# EAGLE design tf520 (EAGLE 7.7.0)

## Sheet 1 of 2
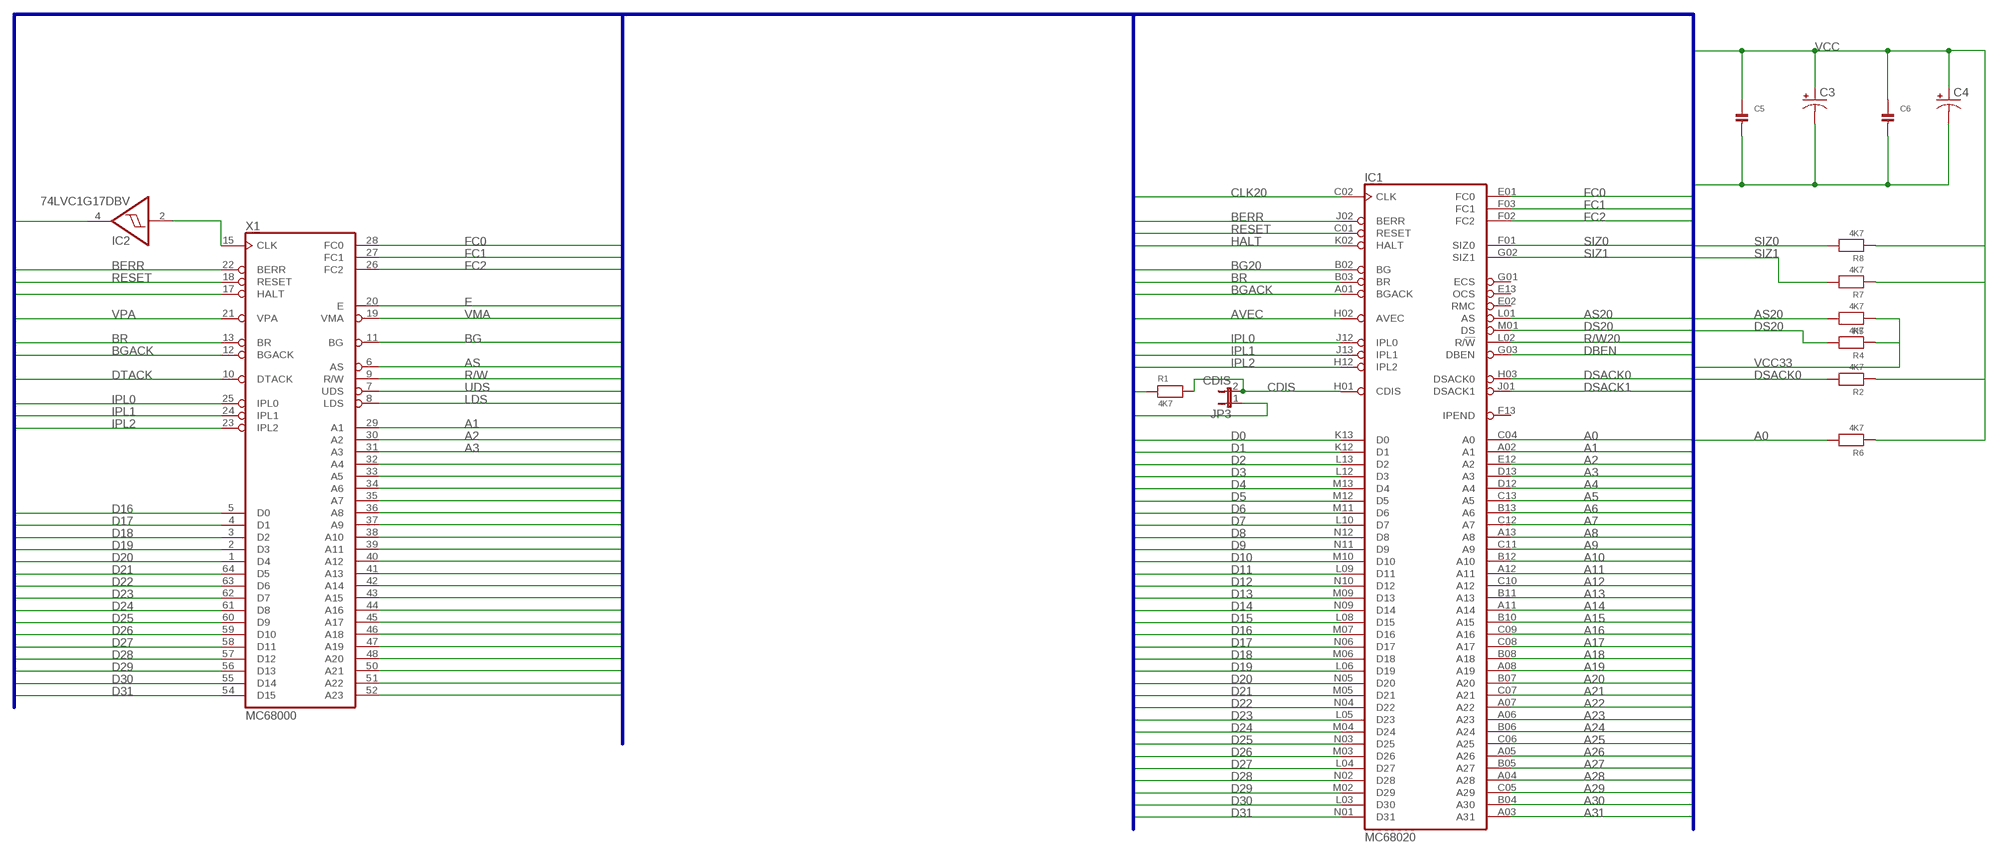
[diagram p0: schematic, sheet 1]

### Parts
C3  CAP_POLD  [PANASONIC_D]
C4  CAP_POLD  [PANASONIC_D]
C5  CAP_CERAMIC1206  [1206]
C6  CAP_CERAMIC1206  [1206]
IC1  MC68020  MC68020RC  [MPGA114]
IC2  74LVC1G17DBV  [SOT23-5]
JP3  CDIS  JUMPER-2PTH  [1X02]
R1  4K7  RESISTOR1206  [1206]
R2  4K7  RESISTOR1206  [1206]
R4  4K7  RESISTOR1206  [1206]
R5  4K7  RESISTOR1206  [1206]
R6  4K7  RESISTOR1206  [1206]
R7  4K7  RESISTOR1206  [1206]
R8  4K7  RESISTOR1206  [1206]
X1  MC68000  MC68000P  [DIL64]

### Nets
A0: IC1.C04(A0) R6.2 ; also sheet 2
A1: IC1.A02(A1) X1.29(A1)
A2: IC1.E12(A2) X1.30(A2)
A3: IC1.D13(A3) X1.31(A3)
A4: IC1.D12(A4) X1.32(A4)
A5: IC1.C13(A5) X1.33(A5)
A6: IC1.B13(A6) X1.34(A6)
A7: IC1.C12(A7) X1.35(A7)
A8: IC1.A13(A8) X1.36(A8)
A9: IC1.C11(A9) X1.37(A9)
A10: IC1.B12(A10) X1.38(A10)
A11: IC1.A12(A11) X1.39(A11)
A12: IC1.C10(A12) X1.40(A12)
A13: IC1.B11(A13) X1.41(A13)
A14: IC1.A11(A14) X1.42(A14)
A15: IC1.B10(A15) X1.43(A15)
A16: IC1.C09(A16) X1.44(A16) ; also sheet 2
A17: IC1.C08(A17) X1.45(A17) ; also sheet 2
A18: IC1.B08(A18) X1.46(A18) ; also sheet 2
A19: IC1.A08(A19) X1.47(A19) ; also sheet 2
A20: IC1.B07(A20) X1.48(A20)
A21: IC1.C07(A21) X1.50(A21)
A22: IC1.A07(A22) X1.51(A22)
A23: IC1.A06(A23) X1.52(A23)
A24: IC1.B06(A24)
A25: IC1.C06(A25)
A26: IC1.A05(A26)
A27: IC1.B05(A27)
A28: IC1.A04(A28)
A29: IC1.C05(A29)
A30: IC1.B04(A30)
A31: IC1.A03(A31)
AS: X1.6(AS) ; also sheet 2
AS20: IC1.L01(AS) R5.2 ; also sheet 2
AVEC: IC1.H02(AVEC) ; also sheet 2
BERR: IC1.J02(BERR) X1.22(BERR) ; also sheet 2
BG: X1.11(BG) ; also sheet 2
BG20: IC1.B02(BG) ; also sheet 2
BGACK: IC1.A01(BGACK) X1.12(BGACK) ; also sheet 2
BR: IC1.B03(BR) X1.13(BR)
CDIS: IC1.H01(CDIS) JP3.2 R1.2
CLK7M: IC2.4(O) ; also sheet 2
CLK7M_RAW: IC2.2(I) X1.15(CLK)
CLK20: IC1.C02(CLK) ; also sheet 2
D0: IC1.K13(D0)
D1: IC1.K12(D1)
D2: IC1.L13(D2)
D3: IC1.L12(D3)
D4: IC1.M13(D4)
D5: IC1.M12(D5)
D6: IC1.M11(D6)
D7: IC1.L10(D7)
D8: IC1.N12(D8)
D9: IC1.N11(D9)
D10: IC1.M10(D10)
D11: IC1.L09(D11)
D12: IC1.N10(D12)
D13: IC1.M09(D13)
D14: IC1.N09(D14)
D15: IC1.L08(D15)
D16: IC1.M07(D16) X1.5(D0)
D17: IC1.N06(D17) X1.4(D1)
D18: IC1.M06(D18) X1.3(D2)
D19: IC1.L06(D19) X1.2(D3)
D20: IC1.N05(D20) X1.1(D4)
D21: IC1.M05(D21) X1.64(D5)
D22: IC1.N04(D22) X1.63(D6)
D23: IC1.L05(D23) X1.62(D7)
D24: IC1.M04(D24) X1.61(D8)
D25: IC1.N03(D25) X1.60(D9)
D26: IC1.M03(D26) X1.59(D10)
D27: IC1.L04(D27) X1.58(D11)
D28: IC1.N02(D28) X1.57(D12)
D29: IC1.M02(D29) X1.56(D13)
D30: IC1.L03(D30) X1.55(D14)
D31: IC1.N01(D31) X1.54(D15)
DBEN: IC1.G03(DBEN)
DS20: IC1.M01(DS) R4.2 ; also sheet 2
DSACK0: IC1.H03(DSACK0) R2.2
DSACK1: IC1.J01(DSACK1) ; also sheet 2
DTACK: X1.10(DTACK) ; also sheet 2
E: X1.20(E) ; also sheet 2
FC0: IC1.E01(FC0) X1.28(FC0) ; also sheet 2
FC1: IC1.F03(FC1) X1.27(FC1) ; also sheet 2
FC2: IC1.F02(FC2) X1.26(FC2) ; also sheet 2
GND: C3.- C4.- C5.2 C6.2 JP3.1 ; also sheet 2
HALT: IC1.K02(HALT) X1.17(HALT) ; also sheet 2
IPL0: IC1.J12(IPL0) X1.25(IPL0)
IPL1: IC1.J13(IPL1) X1.24(IPL1)
IPL2: IC1.H12(IPL2) X1.23(IPL2)
LDS: X1.8(LDS) ; also sheet 2
R/W: X1.9(R/W) ; also sheet 2
R/W20: IC1.L02(R/!W) ; also sheet 2
RESET: IC1.C01(RESET) X1.18(RESET) ; also sheet 2
SIZ0: IC1.F01(SIZ0) R8.2 ; also sheet 2
SIZ1: IC1.G02(SIZ1) R7.2 ; also sheet 2
UDS: X1.7(UDS) ; also sheet 2
VCC: C3.+ C4.+ C5.1 C6.1 R1.1 R2.1 R6.1 R7.1 R8.1 ; also sheet 2
VCC33: R4.1 R5.1 ; also sheet 2
VMA: X1.19(VMA) ; also sheet 2
VPA: X1.21(VPA) ; also sheet 2
Unconnected: IC1.E02(RMC) IC1.E13(OCS) IC1.F13(IPEND) IC1.G01(ECS)

### Buses
VCC33,VCC,GND,CLK7M,A[0..31],D[0..31],IPL[0..2],FC[0..2],DSACK[0..1],BR,BGACK,R/W20,R/W,CLK20,AS20,DS20,BG20,AVEC,SIZ[0..1],DBEN,BERR,RESET,HALT,BG,VPA,VMA,E,AS,UDS,LDS,DTACK

## Sheet 2 of 2
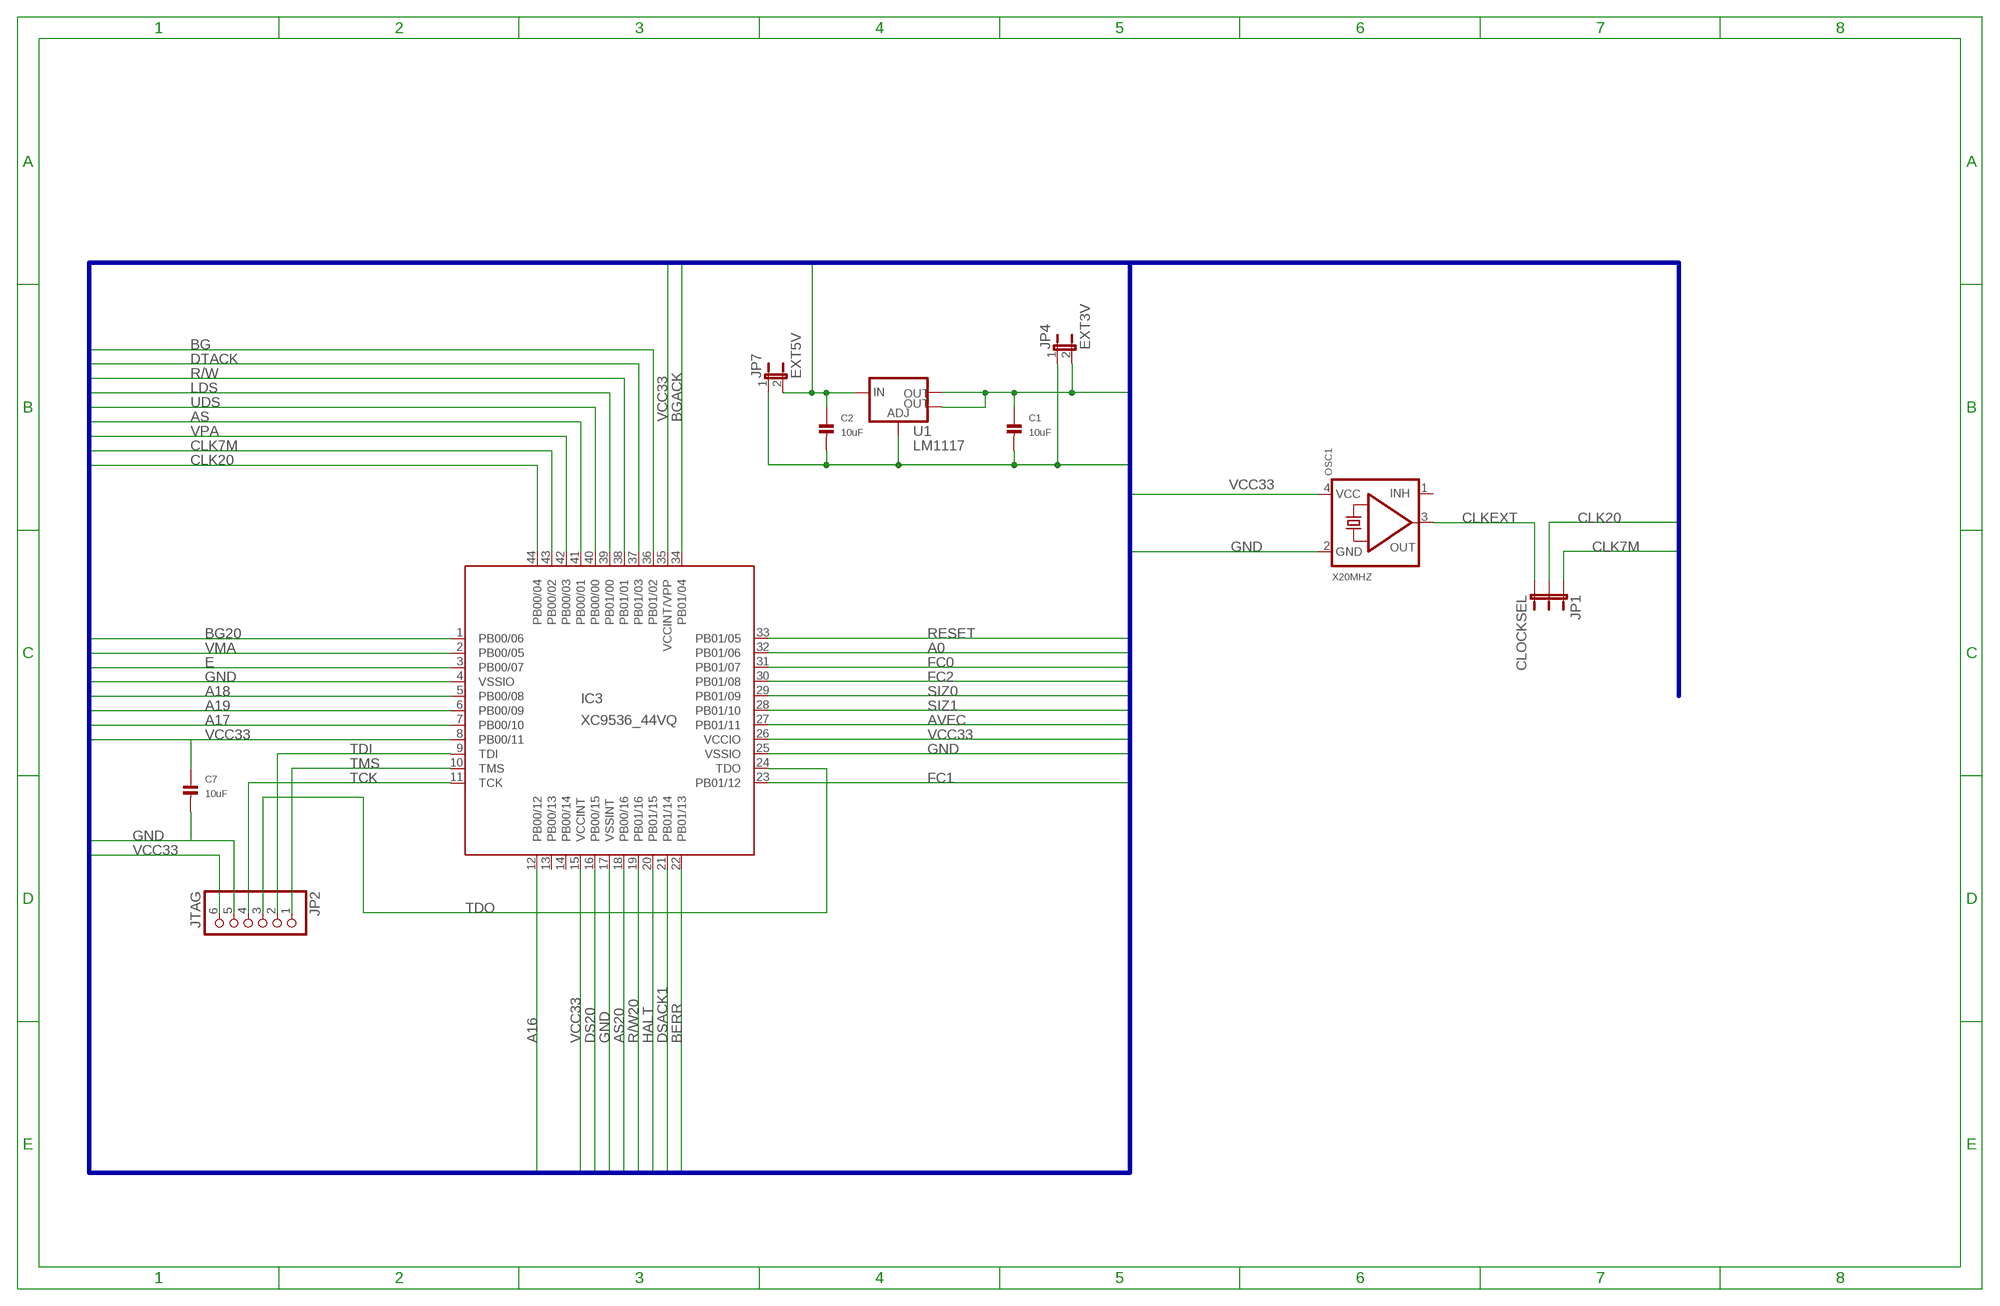
[diagram p1: schematic, sheet 2]

### Parts
C1  10uF  CAP_CERAMIC1206  [1206]
C2  10uF  CAP_CERAMIC1206  [1206]
C7  10uF  CAP_CERAMIC1206  [1206]
IC3  XC9536_44VQ  [SQFP-S-10X10-44]
JP1  CLOCKSEL  JUMPER-3PTH  [1X03]
JP2  JTAG  HEADER-1X6ROUND  [1X06_ROUND]
JP4  EXT3V  JUMPER-2PTH  [1X02]
JP7  EXT5V  JP1E  [JP1]
OSC1  X20MHZ  OSCILLATOR  [OSC_7X5MM]
U1  LM1117  V_REG_LM1117SOT223  [SOT223]

### Nets
A0: IC3.32(PB01/06) ; also sheet 1
A16: IC3.12(PB00/12) ; also sheet 1
A17: IC3.7(PB00/10) ; also sheet 1
A18: IC3.5(PB00/08) ; also sheet 1
A19: IC3.6(PB00/09) ; also sheet 1
AS: IC3.41(PB00/01) ; also sheet 1
AS20: IC3.18(PB00/16) ; also sheet 1
AVEC: IC3.27(PB01/11) ; also sheet 1
BERR: IC3.22(PB01/13) ; also sheet 1
BG: IC3.36(PB01/02) ; also sheet 1
BG20: IC3.1(PB00/06) ; also sheet 1
BGACK: IC3.34(PB01/04) ; also sheet 1
CLK7M: IC3.43(PB00/02) JP1.1 ; also sheet 1
CLK20: IC3.44(PB00/04) JP1.2 ; also sheet 1
CLKEXT: JP1.3 OSC1.3(OUT)
DS20: IC3.16(PB00/15) ; also sheet 1
DSACK1: IC3.21(PB01/14) ; also sheet 1
DTACK: IC3.37(PB01/03) ; also sheet 1
E: IC3.3(PB00/07) ; also sheet 1
FC0: IC3.31(PB01/07) ; also sheet 1
FC1: IC3.23(PB01/12) ; also sheet 1
FC2: IC3.30(PB01/08) ; also sheet 1
GND: C1.2 C2.2 C7.2 IC3.4(VSSIO) IC3.17(VSSINT) IC3.25(VSSIO) JP2.5 JP4.1 JP7.1 OSC1.2(GND) U1.1(ADJ) ; also sheet 1
HALT: IC3.20(PB01/15) ; also sheet 1
LDS: IC3.39(PB01/00) ; also sheet 1
R/W: IC3.38(PB01/01) ; also sheet 1
R/W20: IC3.19(PB01/16) ; also sheet 1
RESET: IC3.33(PB01/05) ; also sheet 1
SIZ0: IC3.29(PB01/09) ; also sheet 1
SIZ1: IC3.28(PB01/10) ; also sheet 1
TCK: IC3.11(TCK) JP2.4
TDI: IC3.9(TDI) JP2.2
TDO: IC3.24(TDO) JP2.3
TMS: IC3.10(TMS) JP2.1
UDS: IC3.40(PB00/00) ; also sheet 1
VCC: C2.1 JP7.2 U1.3(IN) ; also sheet 1
VCC33: C1.1 C7.1 IC3.8(PB00/11) IC3.15(VCCINT) IC3.26(VCCIO) IC3.35(VCCINT/VPP) JP2.6 JP4.2 OSC1.4(VCC) U1.2(OUT) U1.4(OUT) ; also sheet 1
VMA: IC3.2(PB00/05) ; also sheet 1
VPA: IC3.42(PB00/03) ; also sheet 1
Unconnected: IC3.13(PB00/13) IC3.14(PB00/14) OSC1.1(INH)

### Buses
VCC33,VCC,GND,CLK7M,A[0..31],D[0..31],IPL[0..2],FC[0..2],DSACK[0..1],BR,BGACK,R/W20,R/W,CLK20,AS20,DS20,BG20,AVEC,SIZ[0..1],DBEN,BERR,RESET,HALT,BG,VPA,VMA,E,AS,UDS,LDS,DTACK

## Power pins joined to a net without a drawn wire
GND: IC1.A10(GND) IC1.B01(GND) IC1.B09(GND) IC1.C03(GND) IC1.F12(GND) IC1.G12(GND) IC1.H13(GND) IC1.J03(GND) IC1.K01(GND) IC1.K03(GND) IC1.L07(GND) IC1.L11(GND) IC1.N07(GND) IC2.3(GND) X1.16(GND) X1.53(GND)
VCC: IC1.A09(VCC) IC1.D01(VCC) IC1.D02(VCC) IC1.D03(VCC) IC1.E03(VCC) IC1.G11(VCC) IC1.G13(VCC) IC1.M08(VCC) IC1.N08(VCC) IC1.N13(VCC) IC2.5(VCC) X1.14(VCC) X1.49(VCC)

## Library data of the parts
C1 C2 C5-C7 = microbuilder:CAP_CERAMIC: Ceramic Capacitors 0402 - 0402 Surface Mount Capacitors 16pF 50V 5% [Digikey: 445-4899-2-ND] 18pF 50V 5% [Digikey: 490-1281-2-ND] 22pF 50V 5% [Digikey: 490-1283-2-ND] 68pF 50V 5% [Digikey: 490-1289-2-ND] 0.1uF 10V 10% [Digikey: 490-1318-2-ND] 1.0uF 6.3V 10% [Digikey: 490-1320-2-ND] 0603 - 0603 Surface Mount Capacitors 16 pF 50V 5% [Digikey: 445-5051-2-ND] 22 pF 50V [Digikey: PCC220ACVTR-ND] 33 pF 50V 5% [Digikey: 490-1415-1-ND] 56pF 50V 5% [Digikey: 490-1421-1-ND] 220pF 50V 5% [Digikey: 445-1285-1-ND] 680 pF 50V 2200 pF 50V 5% C0G [Digikey: 445-1297-1-ND] 5600 pF 100V 5% X7R [Digikey: 478-3711-1-ND] 0.1 µF 25V 10% [Digikey: PCC2277TR-ND] 0.22 µF 16V 10% X7R [Digikey: 445-1318-1-ND] 1.0 µF 25V 10% [Digikey: 445-5146-2-ND] 0603 - RF Specific 3pF 250V +/-0.1pF RF [Digikey: 712-1347-1-ND] 18 pF 250V 5% [Digikey: 478-3505-1-ND or 712-1322-1-ND] 56 pF 250V 5% C0G RF [Digikey: 490-4867-1-ND] 68 pF 250V RF [Digikey: 490-4868-1-ND] 0805 - 0805 Surface Mount Capacitors 220 pF 250V 2% RF Ceramic Capacitor [Digikey: 712-1398-1-ND] 1000 pF 50V 2% NP0 Ceramic Capacitor [Digikey: 478-3760-1-ND] 0.1 µF 25V 10% Ceramic Capacitor [Digikey: PCC1828TR-ND] 1.0 µF 16V 10% Ceramic Capacitor[Digikey: 490-1691-2-ND] 10.0 µF 10V 10% Ceramic Capacitor[Digikey: 709-1228-1-ND] 10.0 uF 16V 10% Ceramic Capacitor [Digikey: 478-5165-2-ND] 47 uF 6.3V 20% Ceramic Capacitor [Digikey: 587-1779-1-ND or 399-5506-1-ND] 1206 - 1206 Surface Mount Capacitors 47uF 10V 20% Ceramic Capacitor [Digikey: 490-5528-1-ND or 399-5508-1-ND or 445-6010-1-ND] 100uF 6.3V -20%, +80% Y5V Ceramic Capacitor (Digikey: 490-4512-1-ND, Mouser: 81-GRM31CF50J107ZE1L)
C3 C4 = SparkFun-Capacitors:CAP_POL: Capacitor Polarized These are standard SMD and PTH capacitors. Normally 10uF, 47uF, and 100uF in electrolytic and tantalum varieties. Always verify the external diameter of the through hole cap, it varies with capacity, voltage, and manufacturer. The EIA devices should be standard.
IC1 = micro-mc68000:MC68020RC: 68xxx PROCESSOR; MF: MOTOROLA; MPN: MC68020RC33E; OC_FARNELL: 1579779; OC_NEWARK: 66F7091
IC2 = 74xx-little-de:74*1G17: Single Schmitt-Trigger Buffer
IC3 = xilinx-xc9:XC9536_44VQ: xc9536_pc44 XC9500 In-System Programmable CPLD Family Auto generated by make-symbol-device-package-bsdl.ulp Rev. 34 Source: xc9536_vq44.bsd; MPN: XC9536-15VQG44C; OC_FARNELL: 1193227; OC_NEWARK: 98K3377
JP1 = SparkFun-Retired:JUMPER-3
JP2 = microbuilder:HEADER-1X6: PIN HEADER
JP3 JP4 = SparkFun-Retired:JUMPER-2: Jumper Basic 0.1" spaced jumper. Use with breakaway headers.
JP7 = jumper:JP1E: JUMPER
OSC1 = microbuilder:OSCILLATOR: Oscillators 3.2x2.5mm SMT 4.0MHz +/- 50ppm, 3.3V, 9mA, -40/+85°C - Digikey: 535-9752-1-ND 50MHz +/- 50ppm, 3.3V, 8mA, -10/+70°C - Digikey: 478-4792-1-ND 5x7mm SMT 4.0MHz +/-20ppm 3.3V, 20mA, -20/+70°C - Digikey: 535-9329-2-ND 50MHz +/- 25ppm 3.3V, 35mA, -40/+85°C - Digikey: 631-1197-1-ND
R1 R2 R4-R8 = microbuilder:RESISTOR: Resistors 0402 - 0402 Surface Mount Package 22 Ohm 1% 1/16W [Digikey: 311-22.0LRTR-ND] 33 Ohm 5% 1/16W 1.0K 5% 1/16W 1.5K 5% 1/16W 2.0K 1% 1/16W 10.0K 1% 1/16W [Digikey: 311-10.0KLRTR-ND] 10.0K 5% 1/16W [Digikey: RMCF0402JT10K0TR-ND] 12.1K 1% 1/16W [Digikey: 311-22.0LRTR-ND] 100.0K 5% 1/16W 0603 - 0603 Surface Mount Package 0 Ohm 1/10 Watt 1% Resistor 15 Ohm 1/10 Watt 1% Resistor 33 Ohm 1/10 Watt 1% Resistor 49.9 Ohm 1/10 Watt 1% Resistor 100 Ohm 1/10 Watt 1% Resistor 150 Ohm 1/10 Watt 1% Resistor 240 Ohm 1/10 Watt 1% Resistor 390 Ohm 1/10 Watt 1% Resistor 560 Ohm 1/10 Watt 1% Resistor 680 Ohm 1/10 Watt 1% Resistor 750 Ohm 1/10 Watt 1% Resistor 1.0K Ohm 1/10 Watt 1% Resistor 1.5K Ohm 1/10 Watt 1% Resistor 2.0K Ohm 1/10 Watt 1% Resistor 2.2K Ohm 1/10 Watt 1% Resistor 3.3K Ohm 1/10 Watt 1% Resistor 4.7K Ohm 1/10 Watt 1% Resistor 10.0K Ohm 1/10 Watt 1% Resistor 12.0K Ohm 1/10 Watt 1% Resistor 12.1K Ohm 1/10 Watt 1% Resistor 20.0K Ohm 1/10 Watt 1% Resistor 33.0K Ohm 1/10 Watt 1% Resistor 100.0K Ohm 1/10 Watt 1% Resistor 0805 - 0805 Surface Mount Package 0 Ohm 1/8 Watt 1% Resistor 33 Ohm 1/8 Watt 1% Resistor 100 Ohm 1/8 Watt 1% Resistor 150 Ohm 1/8 Watt 1% Resistor 200 Ohm 1/8 Watt 1% Resistor 240 Ohm 1/8 Watt 1% Resistor 330 Ohm 1/8 Watt 1% Resistor 390 Ohm 1/8 Watt 1% Resistor 470 Ohm 1/8 Watt 1% Resistor 1.0K Ohm 1/8 Watt 1% Resistor 1.5K Ohm 1/8 Watt 1% Resistor 2.0K Ohm 1/8 Watt 1% Resistor 4.7K Ohm 1/8 Watt 1% Resistor 5.1K Ohm 1/8 Watt 1% Resistor 5.6K Ohm 1/8 Watt 1% Resistor 10.0K Ohm 1/8 Watt 1% Resistor 22.0K Ohm 1/8 Watt 1% Resistor 33.0K Ohm 1/8 Watt 1% Resistor 100K Ohm 1/8 Watt 1% Resistor 1206 - 1206 Surface Mount Package 2012 - 2010 Surface Mount Package 0.11 Ohm 1/2 Watt 1% Resistor - Digikey: RHM.11UCT-ND
U1 = SparkFun-PowerIC:V_REG_LM1117: Voltage Regulator LM1117 Standard adjustable voltage regulator but in SMD form. Spark Fun Electronics SKU : COM-00595; PROD_ID: VREG-08170
X1 = micro-mc68000:MC68000P: 68xxx PROCESSOR; OC_FARNELL: unknown; OC_NEWARK: unknown

## Board
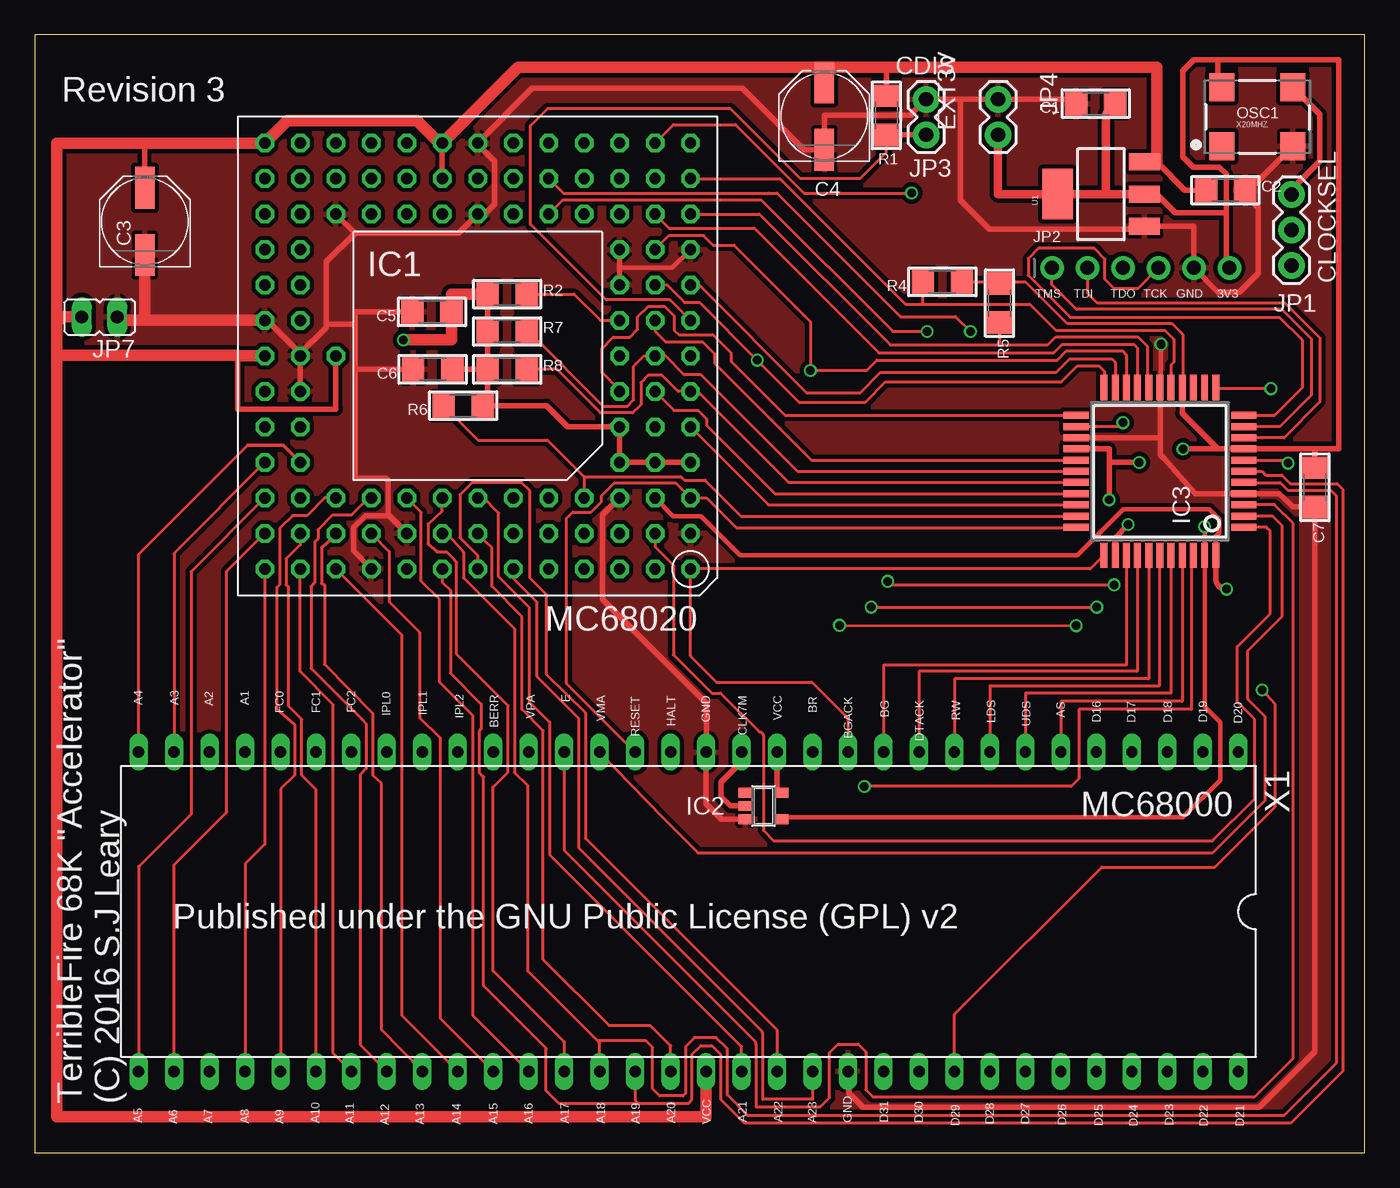
[diagram p2: board, top side]
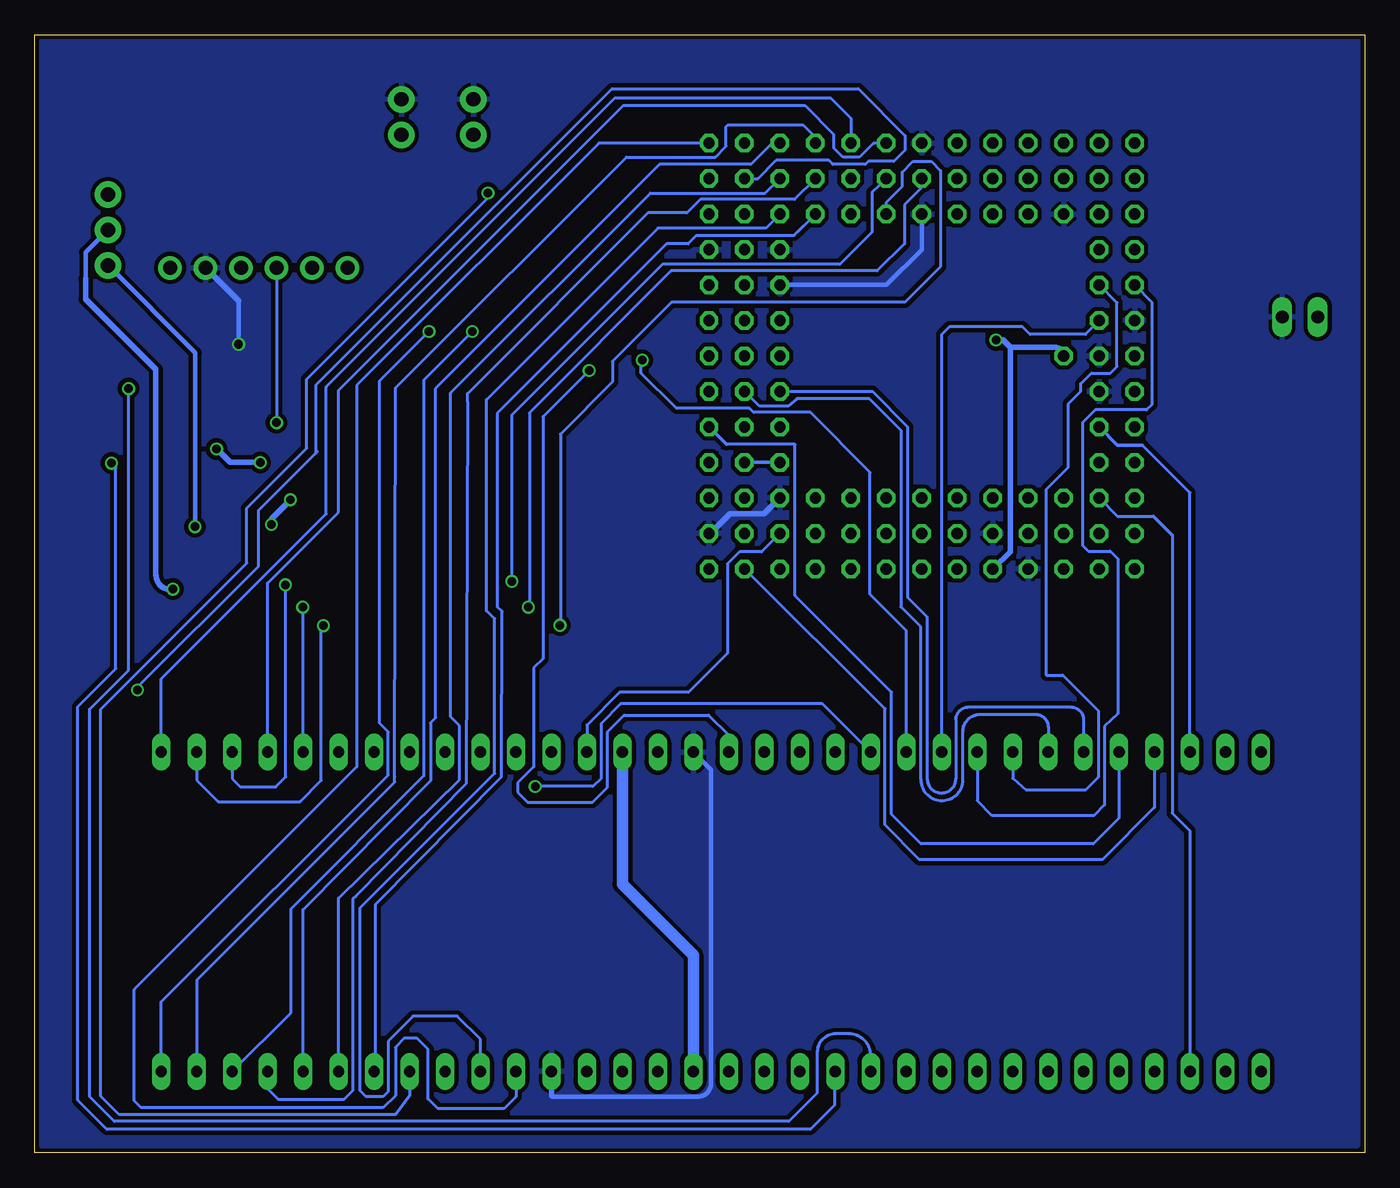
[diagram p3: board, bottom side, seen from below]

Size 95.2 x 80 mm. Coordinates in mm from the lower left corner, seen from the top.
Outline: 0,0 95.2,0 95.2,80 0,80 0,0
Copper layers (1*16): Top 0.035mm / dielectric 1.5mm / Bottom 0.035mm
Design rules "dirt_cheap_dirty_boards.v1": minimum track width 5mil, minimum drill 12mil, track to track 5mil, track to pad 5mil, pad to pad 5mil, via to via 5mil, smd to smd 0mil, copper to edge 10mil, drill to drill 10mil, minimum pad ring 10mil, minimum via ring 6mil, stop-mask expansion 2mil, vias tented up to drill 25mil, thermal gap 10mil

### Footprints (pad centres in the part's own frame; a part is rotated, then mirrored left to right if it is on the bottom)
1206 = smd 1.6 x 1.8: 1 -1.4,0; 2 1.4,0
PANASONIC_D = smd 3 x 1.4: + 2.4,0; - -2.4,0
MPGA114 = drill 0.813 octagon: A01 -15.24,15.24; A02 -12.7,15.24; A03 -10.16,15.24; A04 -7.62,15.24; A05 -5.08,15.24; A06 -2.54,15.24; A07 0,15.24; A08 2.54,15.24; A09 5.08,15.24; A10 7.62,15.24; A11 10.16,15.24; A12 12.7,15.24; A13 15.24,15.24; B01 -15.24,12.7; B02 -12.7,12.7; B03 -10.16,12.7; B04 -7.62,12.7; B05 -5.08,12.7; B06 -2.54,12.7; B07 0,12.7; B08 2.54,12.7; B09 5.08,12.7; B10 7.62,12.7; B11 10.16,12.7; B12 12.7,12.7; B13 15.24,12.7; C01 -15.24,10.16; C02 -12.7,10.16; C03 -10.16,10.16; C04 -7.62,10.16; C05 -5.08,10.16; C06 -2.54,10.16; C07 0,10.16; C08 2.54,10.16; C09 5.08,10.16; C10 7.62,10.16; C11 10.16,10.16; C12 12.7,10.16; C13 15.24,10.16; D01 -15.24,7.62; D02 -12.7,7.62; D03 -10.16,7.62; D12 12.7,7.62; D13 15.24,7.62; E01 -15.24,5.08; E02 -12.7,5.08; E03 -10.16,5.08; E12 12.7,5.08; E13 15.24,5.08; F01 -15.24,2.54; F02 -12.7,2.54; F03 -10.16,2.54; F12 12.7,2.54; F13 15.24,2.54; G01 -15.24,0; G02 -12.7,0; G03 -10.16,0; G11 10.16,0; G12 12.7,0; G13 15.24,0; H01 -15.24,-2.54; H02 -12.7,-2.54; H03 -10.16,-2.54; H12 12.7,-2.54; H13 15.24,-2.54; J01 -15.24,-5.08; J02 -12.7,-5.08; J03 -10.16,-5.08; J12 12.7,-5.08; J13 15.24,-5.08; K01 -15.24,-7.62; K02 -12.7,-7.62; K03 -10.16,-7.62; K12 12.7,-7.62; K13 15.24,-7.62; L01 -15.24,-10.16; L02 -12.7,-10.16; L03 -10.16,-10.16; L04 -7.62,-10.16; L05 -5.08,-10.16; L06 -2.54,-10.16; L07 0,-10.16; L08 2.54,-10.16; L09 5.08,-10.16; L10 7.62,-10.16; L11 10.16,-10.16; L12 12.7,-10.16; L13 15.24,-10.16; M01 -15.24,-12.7; M02 -12.7,-12.7; M03 -10.16,-12.7; M04 -7.62,-12.7; M05 -5.08,-12.7; M06 -2.54,-12.7; M07 0,-12.7; M08 2.54,-12.7; M09 5.08,-12.7; M10 7.62,-12.7; M11 10.16,-12.7; M12 12.7,-12.7; M13 15.24,-12.7; N01 -15.24,-15.24; N02 -12.7,-15.24; N03 -10.16,-15.24; N04 -7.62,-15.24; N05 -5.08,-15.24; N06 -2.54,-15.24; N07 0,-15.24; N08 2.54,-15.24; N09 5.08,-15.24; N10 7.62,-15.24; N11 10.16,-15.24; N12 12.7,-15.24; N13 15.24,-15.24
SOT23-5 = smd 0.69 x 0.99: 1 -0.95,-1.29; 2 0,-1.29; 3 0.95,-1.29; 4 0.95,1.3; 5 -0.95,1.3
SQFP-S-10X10-44 = smd 0.5 x 1.8: 1 -4,-6; 2 -3.2,-6; 3 -2.4,-6; 4 -1.6,-6; 5 -0.8,-6; 6 0,-6; 7 0.8,-6; 8 1.6,-6; 9 2.4,-6; 10 3.2,-6; 11 4,-6; 23 4,6; 24 3.2,6; 25 2.4,6; 26 1.6,6; 27 0.8,6; 28 0,6; 29 -0.8,6; 30 -1.6,6; 31 -2.4,6; 32 -3.2,6; 33 -4,6 | smd 1.8 x 0.5: 12 6,-4; 13 6,-3.2; 14 6,-2.4; 15 6,-1.6; 16 6,-0.8; 17 6,0; 18 6,0.8; 19 6,1.6; 20 6,2.4; 21 6,3.2; 22 6,4; 34 -6,4; 35 -6,3.2; 36 -6,2.4; 37 -6,1.6; 38 -6,0.8; 39 -6,0; 40 -6,-0.8; 41 -6,-1.6; 42 -6,-2.4; 43 -6,-3.2; 44 -6,-4
1X03 = drill 1.016 pad 1.88: 1 0,0; 2 2.54,0; 3 5.08,0
1X06_ROUND = drill 1 pad 1.676: 1 -6.35,0; 2 -3.81,0; 3 -1.27,0; 4 1.27,0; 5 3.81,0; 6 6.35,0
1X02 = drill 1.016 pad 1.88: 1 0,0; 2 2.54,0
JP1 = drill 0.914 long: 1 0,-1.27; 2 0,1.27
OSC_7X5MM = smd 1.8 x 2: 1 -2.54,-2.1; 2 2.54,-2.1; 3 2.54,2.1; 4 -2.54,2.1
SOT223 = smd 1.219 x 2.235: 1 -2.311,-3.099; 2 0,-3.099; 3 2.311,-3.099 | smd 3.6 x 2.2: 4 0,3.099
DIL64 = drill 0.813 long: 1 -39.37,-11.43; 2 -36.83,-11.43; 3 -34.29,-11.43; 4 -31.75,-11.43; 5 -29.21,-11.43; 6 -26.67,-11.43; 7 -24.13,-11.43; 8 -21.59,-11.43; 9 -19.05,-11.43; 10 -16.51,-11.43; 11 -13.97,-11.43; 12 -11.43,-11.43; 13 -8.89,-11.43; 14 -6.35,-11.43; 15 -3.81,-11.43; 16 -1.27,-11.43; 17 1.27,-11.43; 18 3.81,-11.43; 19 6.35,-11.43; 20 8.89,-11.43; 21 11.43,-11.43; 22 13.97,-11.43; 23 16.51,-11.43; 24 19.05,-11.43; 25 21.59,-11.43; 26 24.13,-11.43; 27 26.67,-11.43; 28 29.21,-11.43; 29 31.75,-11.43; 30 34.29,-11.43; 31 36.83,-11.43; 32 39.37,-11.43; 33 39.37,11.43; 34 36.83,11.43; 35 34.29,11.43; 36 31.75,11.43; 37 29.21,11.43; 38 26.67,11.43; 39 24.13,11.43; 40 21.59,11.43; 41 19.05,11.43; 42 16.51,11.43; 43 13.97,11.43; 44 11.43,11.43; 45 8.89,11.43; 46 6.35,11.43; 47 3.81,11.43; 48 1.27,11.43; 49 -1.27,11.43; 50 -3.81,11.43; 51 -6.35,11.43; 52 -8.89,11.43; 53 -11.43,11.43; 54 -13.97,11.43; 55 -16.51,11.43; 56 -19.05,11.43; 57 -21.59,11.43; 58 -24.13,11.43; 59 -26.67,11.43; 60 -29.21,11.43; 61 -31.75,11.43; 62 -34.29,11.43; 63 -36.83,11.43; 64 -39.37,11.43

### Placement (x,y rotation side)
C1  75.95,75.08 180 top
C2  85.24,68.88 0 top
C3  7.87,66.65 90 top
C4  56.52,74.19 90 top
C5  28.42,60.17 180 top
C6  28.47,56.06 180 top
C7  91.64,47.62 270 top
IC1  31.7,57.02 180 top
IC2  52.17,24.82 270 top
IC3  80.54,48.77 90 top
JP1  89.97,63.5 90 top
JP2  79.17,63.32 0 top
JP3  63.8,75.39 270 top
JP4  68.96,75.39 270 top
JP7  4.62,59.82 90 top
OSC1  87.53,74.14 0 top
R1  60.96,74.24 270 top
R2  33.81,61.44 0 top
R4  64.97,62.33 180 top
R5  69.06,60.81 270 top
R6  30.66,53.47 180 top
R7  33.81,58.78 0 top
R8  33.81,56.06 0 top
U1  76.33,68.61 90 top
X1  46.79,17.25 180 top

### Tracks (layer width: path | path; a pad name or v marks a point on that pad's centre or on a via)
A0
  Top 0.203: 39.32,48.39 46.25,48.39 46.51,48.13 47.98,48.13 50.55,45.57 IC3.32 | 39.32,48.39 IC1.C04 | R6.2 31.72,51 36.7,51 39.32,48.39 | IC3.32
A1
  Bottom 0.203: X1.29 15.04,24.71 18.77,20.98 31.88,20.98 34.34,23.47 34.34,31.77 IC1.A02
A2
  Bottom 0.203: X1.30 12.5,47.24 15.9,50.65
  Bottom 0.254: 15.9,50.65 17.7,50.65 IC1.E12
A3
  Top 0.203: IC1.D13 9.96,42.9 X1.31
A4
  Top 0.203: X1.32 7.42,42.82 15.24,50.65
  Top 0.254: 15.24,50.65 17.75,50.65 IC1.D12
A5
  Top 0.203: IC1.C13 11.18,41.58 11.18,24.23 7.42,20.47 X1.33
A6
  Top 0.203: X1.34 9.96,20.6 13.74,24.38 13.74,41.6 IC1.B13
A7
  Bottom 0.203: IC1.C12 17.7,45.57 15.14,45.57 | 13.77,44.2 13.77,24.31 12.5,23.04 X1.35
  Bottom 0.254: 15.14,45.57 13.77,44.2
A8
  Top 0.203: IC1.A13 16.46,22.07 15.06,20.68 15.06,5.84 X1.36
A9
  Top 0.203: X1.37 17.6,5.84 17.6,26.04 18.59,27.03 18.59,30.63 17.53,31.57 17.32,31.77 17.32,40.49 17.35,40.49 17.53,40.66 17.53,44.68 18.44,45.59 19.48,45.59 20.75,46.86 IC1.C11
A10
  Top 0.203: IC1.B12 19,43.51 17.98,42.49 17.98,40.66 18.16,40.51 18.16,31.95 19.1,31.01 19.1,27 20.12,25.98 X1.38
A11
  Top 0.203: X1.39 21.36,7.11 21.36,32.05 18.97,34.44 18.97,41.76
  Top 0.254: 18.97,41.76 IC1.A12
A12
  Top 0.203: 23.85,7.16 X1.40 23.29,7.72 23.29,27.05 23.72,27.51 23.72,30.68 23.42,31.01 | 23.9,46.86 22.68,45.64 21.31,45.64 20.27,44.6 20.27,43.94 20.04,43.71 20.04,40.79 19.76,40.51 19.76,34.67 23.42,31.01 | 23.44,30.99 23.42,31.01
  Top 0.254: 23.9,46.86 IC1.C10
A13
  Top 0.203: X1.41 24.82,8.81 24.82,26.44 24.18,27.03 24.18,31.45 20.73,34.95 20.73,40.64 20.52,40.74 20.52,43.28
  Top 0.254: 20.52,43.28 21.54,44.2 IC1.B11
A14
  Top 0.203: IC1.A11 26.26,37.06 26.26,9.83 X1.42
A15
  Top 0.203: IC1.B10 25.38,43.03 25.38,39.42 27.56,37.24 27.56,31.14 29.03,29.67 29.03,9.6 X1.43
A16  (via drill 0.61)
  Top 0.203: IC1.C09 27.66,45.82 27.66,40.89 28.96,39.6 28.96,33.68 31.34,31.29 31.34,9.83 X1.44 | v88.49,54.69 84.63,54.69 IC3.12
  Bottom 0.203: 88.47,54.76 88.52,54.71 v88.49,54.69 88.49,34.54 91.29,31.75 91.29,4.01 89.51,2.23 41.22,2.23 39.19,4.27 39.19,7.19 arc90 37.87,8.51 36.91,8.51 arc90 35.36,6.96 X1.44
A17  (via drill 0.61)
  Top 0.203: 37.9,7.9 37.87,7.92 | 37.87,7.92 32.79,13.01 32.79,26.16 33.86,27.23 33.88,32 30.2,35.66 30.2,42.24 30.02,42.47 29.49,43 28.78,43 28.14,43.56 28.14,44.98 29.16,45.92 IC1.C08 | 86.67,49.4 IC3.7 89.5,49.57 v89.71,49.35 | X1.45 37.9,7.95 37.87,7.92
  Bottom 0.203: X1.45 37.9,5.23 | 37.9,5.23 37.9,4.7 | 37.9,5.23 37.92,5.21 37.92,3.43 39.67,1.68 90.04,1.68 92.13,3.76 92.13,31.93 89.41,34.65 89.41,49.05 v89.71,49.35
A18
  Top 0.203: 40.27,8.01 40.44,7.85 X1.46 | 40.27,8.01 35.31,12.98 35.31,26.26 34.34,27.2 34.34,37.52 30.68,41.15 30.68,42.98 30.61,43.08 29.46,44.32 | 40.27,8.01 43.75,8.01 44.22,7.54 44.22,4.57 44.73,4.06 46.41,4.06 46.58,4.24 46.58,7.59 47.22,8.23 48.77,8.23 49.58,7.44 49.58,4.14 51.03,2.69 89.43,2.69 93.19,6.45 93.19,46.99 92.79,47.4 89.71,47.4 89.15,47.95 86.54,47.95 IC3.5
  Top 0.254: IC1.B08 29.46,44.32
A19
  Top 0.203: IC1.A08 29.16,40.84 29.74,40.26 29.74,34.31 31.95,32.11 31.95,30.33 31.8,30.15 31.8,27.23 32.05,26.95 32.13,26.87 32.13,11.94 36.6,7.47 36.6,4.45 37.49,3.56 43.18,3.56 | 43.18,3.56 46.81,3.56 47.04,3.83 47.04,7.04 47.68,7.67 48.46,7.67 49.1,7.04 49.1,3.81 50.75,2.16 89.97,2.16 93.62,5.82 93.62,47.5 93.24,47.88 89.89,47.88 89.28,48.49 88.14,48.49 87.86,48.77 IC3.6 | X1.47 42.98,3.76 43.18,3.56
A20
  Top 0.203: IC1.B07 31.7,44.27 32.72,43.28 32.72,40.54 34.87,38.35 34.87,31.73 36.4,30.2 36.4,13.82 41.1,9.12 44.04,9.12 45.52,7.64 | X1.48 45.52,7.64 | 45.52,7.64 45.52,7.67
A21
  Top 0.203: IC1.C07 32.11,46.86 33.2,45.77 33.2,41.22 35.41,39.01 35.41,32.23 36.85,30.81 36.85,21.34 50.6,7.59 X1.50
A22
  Top 0.203: IC1.A07 31.7,42.75 30.43,44.02 30.43,47.09 31.29,47.95 34.85,47.95 35.43,47.37 35.43,41.12 36.63,39.93 36.63,34.21 39.42,31.47 39.42,22.5 53.14,8.79 X1.51
A23
  Top 0.203: IC1.A06 34.21,41.76 34.21,41.15 35.97,39.4 35.97,34.06 38.94,31.09 38.94,21.82 51.98,8.78 arc-45 52.12,8.43 52.12,3.81 55.68,3.81 X1.52
AS
  Top 0.203: X1.6 73.46,32.31 82.14,32.31 IC3.41
AS20
  Top 0.203: IC1.L01 51.87,67.18 61.24,57.81 68.89,57.81 | R5.2 69.06,57.99 68.89,57.81 | 68.89,57.81 72.52,57.81 73.1,58.4 78.97,58.4 79.65,57.71 79.65,54.86 IC3.18
AVEC
  Top 0.203: IC1.H02 44.4,58.8 45.16,58.04 47.8,58.04 48.69,57.15 48.69,56.46 55.59,49.57 IC3.27
BERR  (via drill 0.61)
  Top 0.203: IC1.J02 45.26,62.1 46.51,60.86 47.57,60.86 v51.71,56.72 54.71,53.72 59.46,53.72 60.91,55.17 73.51,55.17 74.65,56.31 76.17,56.31 76.56,55.93 76.56,54.78 IC3.22
  Bottom 0.203: X1.22 32.82,37.36 35.41,39.95 35.41,48.69 39.67,52.98 43.74,52.98 44.04,53.26 49.25,53.26 51.79,55.8 51.79,56.31 51.71,56.31 v51.71,56.72
BG
  Top 0.203: X1.11 60.76,34.9 78.14,34.9 IC3.36
BG20
  Top 0.203: IC1.B02 44.4,43.36 45.72,42.04 45.72,35.64 48.46,32.89 49.1,32.89 51.87,30.12 arc-90 52.15,29.84 52.15,23.06 52.88,22.33 84.3,22.33 87.33,25.35 87.33,31.01 86.08,32.26 86.08,36.22 88.44,38.58 88.44,44.5 88.16,44.78 86.56,44.78 IC3.1
BGACK
  Top 0.203: X1.12 58.22,31.09 55.63,33.68 48.79,33.68 46.94,35.53 IC1.A01 75.56,41.78 IC3.34
BR
  Bottom 0.203: IC1.B03 43.18,43 44.76,43 45.62,42.14 45.62,35.74 48.41,32.94 53.34,32.94 55.68,30.61 X1.13
CDIS
  Top 0.203: IC1.H01 45.47,61.04 40.89,61.04 35.48,66.45 35.48,73.51 36.7,74.73 49.78,74.73 54.76,69.75 59.11,69.75 60.96,71.6 R1.2
  Top 0.406: R1.2 JP3.2
CLK7M  (via drill 0.61)
  Top 0.254: 83.77,42.74 IC3.43
  Top 0.305: IC2.4 53.61,24 82.19,24 84.86,26.67 84.86,30.81 83.74,31.93 IC3.43 v83.74,44.8 v83.74,44.81
  Bottom 0.305: v83.74,44.81 83.72,44.83 83.72,57.25 JP1.1
CLK7M_RAW
  Top 0.406: IC2.2 49.78,24.82 49.12,25.48 49.12,26.52 50.6,27.99 X1.15
CLK20  (via drill 0.61)
  Top 0.305: IC1.C02 45.7,45.57 47.68,45.57 50.49,42.75 74.62,42.75 77.93,46.05 84.1,46.05 84.81,45.34 84.81,44.37 84.54,44.11 IC3.44
  Top 0.406: IC3.44 84.54,41.11 arc90 v85.32,40.34
  Bottom 0.305: JP1.2 91.57,64.44 91.57,62.53
  Bottom 0.406: 91.57,62.53 91.57,61.09 86.54,56.06 86.54,41.35 arc-100 v85.32,40.34
CLKEXT
  Top 0.305: 89.97,68.91 JP1.3
  Top 0.406: OSC1.3 92,74.31 92,70.94 89.97,68.91
D16  (via drill 0.61)
  Top 0.203: v59.87,39.04 v76.02,39.04
  Bottom 0.203: IC1.M07 31.7,69.09 32.94,67.84 32.94,65.05 34.9,63.12 49.66,63.12 59.79,52.96 59.79,39.12 v59.87,39.04 | X1.5 76,39.01 v76.02,39.04
D17
  Bottom 0.203: X1.4 78.54,40.77 73.46,45.85 73.46,54.56 53.06,74.95 40.08,74.95 38,72.87 38,71.91 37.34,71.25 36.17,71.25 35.15,72.26 IC1.N06
D18  (via drill 0.61)
  Top 0.203: v61.06,40.89 61.32,40.64 v77.27,40.64
  Bottom 0.203: IC1.M06 35.26,68.76 35.26,65.89 37.57,63.58 50.27,63.58 61.06,52.78 v61.06,40.89 | X1.3 81.08,26.77 80.49,26.19 77.95,26.19 77.24,26.9 77.24,40.23 v77.27,40.64
D19  (via drill 0.61)
  Top 0.203: v57.61,37.74 v74.55,37.72
  Bottom 0.203: IC1.L06 34.24,68.02 33.1,69.16 33.1,70.18 32.33,70.94 31.01,70.94 30.35,70.28 30.35,63.42 32.89,60.88 49.61,60.88 53.85,56.64 53.85,55.17 57.58,51.44 57.58,37.77 v57.61,37.74 | X1.2 83.62,26.67 82.07,25.12 76.22,25.12 74.7,26.64 74.7,37.57 v74.55,37.72
D20
  Bottom 0.203: X1.1 86.16,33.91 74.35,45.72 74.35,54.81 53.67,75.49 38.23,75.49 36.78,74.04 IC1.N05
D21  (via drill 0.61)
  Top 0.203: IC1.M05 37.85,68.66 52.55,68.68 53.14,68.68 61.98,59.84 65.91,59.84 v66.98,58.78
  Bottom 0.203: X1.64 86.16,10.82 69.9,27.03 69.9,30.12 70.51,30.73 70.51,55.24 v66.98,58.78
D22
  Bottom 0.203: IC1.N04 39.32,72.67 40.21,73.56 45.59,73.56 45.72,73.43 45.72,72.03 46.48,71.25 52.86,71.25 69.37,54.74 69.44,26.92 69.44,26.52 83.62,12.34 X1.63
D23  (via drill 0.61)
  Top 0.203: IC1.L05 37.8,68.2 51.99,68.2 61.42,58.78 v63.88,58.78
  Bottom 0.203: X1.62 76.86,10.03 76.86,17.45 67.36,26.98 67.36,55.3 v63.88,58.78
D24
  Bottom 0.203: IC1.M04 40.82,68.22 47.55,68.22 48.51,67.26 51.31,67.26 64.24,54.33 64.24,53.75 64.34,26.39 72.21,18.39 72.44,18.16 72.44,4.45 73.05,3.83 77.8,3.83 78.54,4.57 X1.61
D25
  Bottom 0.203: X1.60 76,17.4 66.88,26.62 66.88,30.76 66.5,31.14 66.5,54.71 50.47,70.74 43.94,70.74 42.42,72.26 IC1.N03
D26
  Bottom 0.203: X1.59 73.46,18.21 64.8,26.7 64.8,30.56 65.43,31.19 65.43,54.38 51.13,68.68 42.93,68.68 IC1.M03
D27
  Bottom 0.203: X1.58 70.84,5.89 70.84,17.73 61.8,26.9 61.75,38.73 62.1,39.09 62.1,52.91 49.96,65.05 48.44,65.05 47.83,65.66 40.84,65.66 IC1.L04 40.62,65.89
D28  (via drill 0.61)
  Top 0.203: IC1.N02 45.72,73.58 50.16,73.58 55.07,68.68 v62.76,68.68
  Bottom 0.203: X1.57 68.38,4.06 69.37,2.72 89.15,2.72 90.47,4.04 90.47,31.75 80.03,42.19 80.03,46.13 75.74,50.42 75.74,55.37 62.76,68.35 v62.76,68.68
D29  (via drill 0.61)
  Top 0.203: X1.56 65.84,9.91 76.38,20.45 84.48,20.45 88.8,24.77 88.8,32.08 v87.86,33.12
  Bottom 0.203: v87.86,33.12 87.86,33.3 79.2,41.96 79.2,45.97 75.09,50.08 | 75.09,50.08 74.98,50.19 | IC1.M02 43.43,69.72 42.14,71.02 38.35,71.02 38.08,70.74 35.74,70.74 35.53,70.94 33.71,70.94 32.89,71.75 32.89,72.8 36.25,76.15 53.87,76.15 75.09,54.93 75.09,50.08
D30
  Bottom 0.203: X1.55 63.3,8.1 64.97,9.78 68.12,9.78 69.9,7.98 69.9,4.37 70.28,4.01 71.5,4.01 71.93,4.45 71.93,17.53 62.28,27.15 62.28,38.23 62.87,38.79 62.87,53.9 50.6,66.17 42.88,66.17 IC1.L03
D31
  Bottom 0.203: IC1.N01 54.81,72.26 72.16,54.91 72.16,27.61 88.09,11.68 88.09,3.71 87.61,3.23 70.28,3.23 69.39,4.09 69.39,7.54 68.76,8.2 67.84,8.2 67.06,7.42 67.06,3.86 66.34,3.15 61.62,3.15 60.76,4.01 X1.54
DS20
  Top 0.203: IC1.M01 53.34,69.72 62.33,60.73 63.52,60.73 | 63.42,62.51 63.52,62.51 63.52,60.73 | 63.52,60.73 71.22,60.73 73.1,58.85 80.9,58.85 81.53,58.22 81.53,56.57 81.34,56.38 IC3.16
  Top 0.305: R4.2 63.52,62.38 63.52,62.51
DSACK0
  Top 0.203: R2.2 38.61,61.44 40.49,59.56 IC1.H03
DSACK1
  Top 0.203: IC1.J01 47.55,62.1 55.24,54.41 59.11,54.41 60.55,55.85 73.13,55.85 74.09,56.82 77.09,56.82 77.34,56.57 IC3.21 | IC3.21
DTACK
  Top 0.203: X1.10 63.3,34.44 78.92,34.44 78.92,42.74
  Top 0.254: IC3.37 78.92,42.74
E
  Top 0.203: X1.20 37.9,21.64 51.51,8.03 arc-45 51.64,7.72 51.64,3.28 56.24,3.28 56.9,3.94 56.9,7.16 57.51,7.77 58.95,7.77 59.51,7.21 59.49,7.19 59.49,4.5 59.99,3.99 87.33,3.99 90.09,6.76 90.09,45.03 88.75,46.38 86.56,46.38 IC3.3
FC0
  Top 0.203: IC1.E01 52.51,46.37 IC3.31
  Bottom 0.203: X1.28 17.58,23.95 19.43,22.1 31.75,22.1 33.86,24.21 33.86,32.97 40.77,39.88 40.77,50.67 40.79,50.7 45.7,50.7
  Bottom 0.254: 45.7,50.7 IC1.E01
FC1
  Top 0.203: IC1.F03 41.86,54.59 40.59,55.85 40.59,57.56 41.4,58.37 42.6,58.37 43.16,58.93 43.16,59.82 43.92,60.58 45.09,60.58 45.77,59.89 45.77,58.88 46.1,58.55 48.54,58.55 49.86,57.23 49.86,56.62 53.71,52.77 IC3.23
  Bottom 0.203: 20.12,29.84 X1.27 20.12,30.96 arc-90 21.06,31.9 28.35,31.9 arc-90 29.26,30.99 29.26,26.77 arc180 31.32,26.77 31.32,38.35 32.72,39.75 32.72,51.94 35.23,54.48 IC1.F03
FC2
  Top 0.203: IC1.F02 45.74,53.14 47.47,53.14 48.11,52.5 48.11,52.05 52.98,47.17 IC3.30
  Bottom 0.203: X1.26 22.66,30.48 arc-90 23.55,31.37 27.53,31.37 arc-90 28.75,30.15 28.75,26.52 arc172 31.77,26.72 31.77,37.64 33.2,39.06 33.2,51.71 35.46,53.98 40.64,53.98 41.27,53.44 43.31,53.44 IC1.F02
GND  (via drill 0.61)
  Top 0.203: 86.64,68.55 C2.2 | 80.57,54.89 IC3.17 | 31.65,72.21 IC1.N07
  Top 0.254: 80.57,53.87 80.57,54.69 IC3.17 | 20.88,62.33 20.85,62.31 | 22.91,52.78 22.91,52.43
  Top 0.305: v80.62,57.86 80.62,54.84 IC3.17 | IC1.K01 45.62,63.32 41.86,63.32
  Top 0.406: IC1.L11 22.91,65.81 | 22.91,65.81 30.33,65.81 IC1.L07 | 31.57,67.18 IC1.L07 | 22.91,65.81 20.85,63.75 20.85,62.31 20.85,59.28 | 20.85,59.28 20.85,59.05 19,57.2 | 19,57.2 IC1.G12 IC1.F12 | 19,57.2 16.64,59.56 IC1.H13 | 66.27,75.39 JP4.1 74.95,75.39 C1.2 | C2.2 86.91,68.89 OSC1.2 | IC1.J03 41.86,63.32 IC1.K03 | X1.16 47.98,28.6 47.98,28.57 | JP7.1 6.6,59.56 | IC1.A10 22.84,43.08 22.84,44.76 23.67,45.59 25.4,45.59 26.16,44.83 IC1.B09 25.27,45.67 25.27,48.11 25.09,48.28 22.91,48.28 22.91,52.43 22.91,56.16 | 22.91,56.16 22.91,59.16 | 22.91,59.16 22.78,59.28 20.85,59.28 | 86.64,68.55 87.58,67.61 87.58,62.94 86.23,61.59 84.71,61.59 JP2.5 82.98,66.29 U1.1 79.22,66.09 68.35,66.09 66.27,68.17 66.27,75.39 | X1.53 58.27,5.77 58.27,4.27 59.28,3.25 87.65,3.25 91.64,7.24 C7.2 90.05,46.23 89.1,47.17 IC3.4 83.08,47.17 80.85,49.66 80.57,49.94 80.57,51.17 | IC1.C03 40.64,45.64 40.64,39.62 48.08,32.18 48.08,28.7 X1.16 | 80.57,51.17 IC3.25 | IC1.L07 32.21,67.18 32.92,67.89 32.92,70.94 31.65,72.21 | 31.67,72.26 IC1.N07 35.61,76.17 50.67,76.17 55.05,71.79 C4.- 56.52,74.24 62.76,74.24 62.76,74.35 JP3.1 66.27,75.39 | 80.57,51.17 80.57,53.87 | C6.2 23.01,56.06 22.91,56.16 | C5.2 22.91,60.17 22.91,59.16 | IC2.3 49.16,23.87 48.06,24.97 X1.16
  Top 0.813: C3.- 7.87,59.56 | 7.87,59.56 IC1.H13 | 6.6,59.56 7.87,59.56
  Bottom 0.203: 80.59,60.94 80.62,60.96
  Bottom 0.305: IC1.L07 31.7,64.64 34.24,62.1 IC1.J03 | X1.16 46.79,27.41 46.79,4.95 arc90 47.73,4.01 58.14,4.01 arc90 58.22,4.09 | 80.59,60.94 80.59,57.89 v80.62,57.86
  Bottom 0.406: IC1.C03 43,45.72 45.44,45.72 46.84,44.32 IC1.B01 | JP2.5 80.62,60.96 | X1.53 58.22,4.09
  pour Top (isolate 0.305): 0.38,79.58 94.67,79.58 94.67,0.48 0.33,0.48 0.33,79.58
  pour Bottom (isolate 0.305): 0.41,79.55 94.72,79.55 94.72,0.48 0.53,0.48 0.53,0.64 0.33,0.64 0.33,79.63
HALT  (via drill 0.61)
  Top 0.203: IC1.K02 45.41,65.66 47.88,65.66 47.88,65.63 48.56,64.95 50.06,64.95 55.52,59.49 v55.52,55.98 59.54,55.98 60.27,56.72 73.2,56.72 73.86,57.38 77.88,57.38 78.13,57.12 IC3.20
  Bottom 0.203: X1.17 45.52,29.87 46.97,31.32 53.01,31.32 54.2,30.12 54.2,26.16 55.27,25.09 59.92,25.09 60.63,25.81 60.63,26.47 59.49,27.61 59.49,34.7 58.83,35.36 58.83,52.68 v55.52,55.98
IPL0
  Bottom 0.203: IC1.J12 17.73,60.83 17.73,56.26 18.19,55.8 19.56,55.8 20.32,55.04 20.32,54.48 21.21,53.59 21.21,49.05 22.78,47.47 22.78,34.19 21.61,34.19 19.07,31.65 19.07,26.87 19.99,25.96 24.21,25.96 25.2,26.8 X1.25
IPL1
  Bottom 0.203: IC1.J13 15.24,60.88 15.24,53.54 15.62,53.16 19.28,53.16 20.19,52.25 20.19,43.46 19.79,43.05 18.21,43.05 17.68,42.52 17.68,31.42 18.62,30.5 18.62,24.89 19.38,24.13 26.67,24.13 27.74,25.2 X1.24
IPL2
  Bottom 0.203: IC1.H12 19.99,58.57 23.95,58.57 24.51,59.13 29.72,59.13 30.28,58.57 X1.23
LDS
  Top 0.203: 80.52,42.74 80.52,33.43 68.38,33.43 X1.8
  Top 0.254: IC3.39 80.52,42.74
R/W
  Top 0.203: IC3.38 79.74,33.91 65.84,33.91 X1.9
R/W20
  Top 0.203: IC1.L02 45.41,66.17 51.51,66.17 60.43,57.25 72.95,57.25 73.56,57.86 78.69,57.86 78.94,57.61 IC3.19 | IC3.19
RESET
  Top 0.203: X1.18 38.08,33.58 38.08,45.41 38.51,45.85 39.83,45.85 40.56,46.58 40.56,47.02 41.45,47.9 45.9,47.9 IC1.C01 48.08,46.86 50.22,44.73 74.5,44.73 IC3.33
SIZ0
  Top 0.203: R8.2 37.39,56.06 40.49,52.96 42.8,52.96 43.38,53.54 43.38,55.12 43.89,55.63 44.91,55.63 46.05,54.48 IC1.F01 47.45,54.48 53.96,47.97 IC3.29
SIZ1
  Top 0.203: R7.2 35.33,58.78 40.66,53.44 42.44,53.44 42.88,53.87 42.88,56.29 43.61,57.02 IC1.G02 45.14,57.02 46.48,55.68 47.7,55.68 54.61,48.77 IC3.28
TCK
  Top 0.203: JP2.4 78.97,61.85 77.27,61.85 76.61,62.51 76.61,63.96 75.84,64.72 71.86,64.72 71.12,63.98 71.12,62.79 74.12,59.79 89.1,59.79 90.73,58.17 90.73,54.74 88.76,52.77 IC3.11
TDI
  Top 0.203: 87.87,51.17 IC3.9 | 87.89,51.18 87.87,51.17 | JP2.2 75.36,61.52 76.07,60.81 89.51,60.81 92,58.32 92,53.73 89.43,51.17 87.87,51.17
TDO  (via drill 0.61)
  Top 0.203: 74.68,52.05 IC3.24 77.62,51.97 v77.9,52.25
  Bottom 0.203: JP2.3 77.9,52.5 77.9,52.27 v77.9,52.25
TMS
  Top 0.203: IC3.10 89.13,51.97 91.39,54.23 91.39,58.24 89.28,60.35 74.57,60.35 72.82,62.1 JP2.1
UDS
  Top 0.203: IC3.40 81.34,32.89 70.92,32.89 X1.7
VCC  (via drill 0.61)
  Top 0.406: 28.96,72.26 IC1.N08 IC1.M08 | U1.3 80.31,70.92 82.35,68.89 C2.1 | 26.54,41.71 IC1.A09 | IC1.D01 IC1.D02 IC1.D03 IC1.E03 38.15,51.94 36.63,53.47 R6.1 32.41,53.82 R8.1 | 16.41,72.26 IC1.N13 | C3.+ 7.87,72.26 | 14.53,57.07 14.53,57.02 14.53,53.21 21.54,53.21 IC1.G11 | C4.+ 56.52,77.65 56.57,77.7 | R1.1 60.96,77.55 60.81,77.7 | R8.1 R7.1 R2.1 | C6.1 R8.1 | IC2.5 53.14,26.1 X1.14
  Top 0.813: 28.96,72.26 27.36,73.86 18.06,73.86 IC1.N13 7.87,72.26 1.57,72.26 1.57,59.44 | 14.53,57.02 IC1.G13 | X1.49 48.06,2.59 1.57,2.59 1.57,57.07 | 1.57,57.07 1.57,59.44 | 14.53,57.07 1.57,57.07 | JP7.2 1.96,59.82 1.57,59.44 | IC1.N08 34.59,77.7 56.57,77.7 60.81,77.7 80.31,77.7 80.31,70.92 | R2.1 29.82,61.44 C5.1 29.82,58.17 v26.39,58.17
  Bottom 0.254: IC1.D03 IC1.D02
  Bottom 0.406: IC1.A09 25.38,43.03 25.38,57.63 | 25.38,57.63 25.91,58.17 v26.39,58.17 | 25.38,57.63 22.15,57.63 arc90 IC1.G11
  Bottom 0.813: X1.14 53.14,19.23 48.06,14.15 X1.49
VCC33  (via drill 0.6, 0.61)
  Top 0.203: R5.1 69.06,62.33 R4.1 70.92,62.33 73.89,59.36 81.38,59.36 82.17,58.57 82.17,54.79 IC3.15 | 78.26,44.93 v78.26,44.96
  Top 0.254: 77.34,74.95 C1.1 | 84.86,76.17 OSC1.4
  Top 0.406: 79.55,68.61 U1.2 80.11,68.81 81.66,67.26 85.29,67.26 | 91.64,50.37 93.34,50.37 93.34,78.23 84.68,78.23 | 91.64,50.37 IC3.8 84.68,50.37 | 84.93,76.24 OSC1.4 | IC3.15 82.14,52.91 84.68,50.37 | IC3.26 76.91,50.37 76.91,49.4 | 84.86,76.17 84.68,76.35 84.68,78.23 | 84.68,50.37 82.14,50.37 v82.19,50.37 | 77.39,49.4 v79.07,49.4 76.91,49.4 | JP2.6 85.29,63.55 85.29,67.26 | 85.29,67.26 85.29,70.05 84.81,70.54 82.93,70.54 82.19,71.27 82.19,77.42 82.98,78.21 84.66,78.21 84.68,78.23 | C7.1 91.64,50.37 | IC3.35 77.34,44.02 78.26,44.93 | v76.91,46.74 76.91,49.4
  Top 0.61: JP4.2 68.96,68.61 U1.4 76.68,68.61 | U1.2 76.68,68.61 | 77.34,74.95 76.68,74.3 76.68,68.61
  Bottom 0.203: 76.89,46.74 v76.91,46.74
  Bottom 0.406: v79.07,49.4 81.23,49.4 v82.19,50.37 | v78.26,44.96 78.26,45.36 76.89,46.74
VMA
  Top 0.203: X1.19 44.96,23.98 47.47,21.46 84.33,21.46 88.09,25.22 88.09,31.22 86.84,32.46 86.84,35.94 89.31,38.41 89.31,44.88 88.62,45.57 IC3.2
VPA  (via drill 0.61)
  Top 0.203: IC3.42 82.8,42.7 82.8,31.73 74.78,31.73 74.78,26.8 74.19,26.21 v59.38,26.21
  Bottom 0.203: X1.21 38.81,32.13 53.26,32.13 54.66,30.71 54.66,26.77 55.24,26.21 v59.38,26.21

### Text on the board
tNames: Revision 3 | TMS | TDI | TDO | TCK | GND | 3V3 | A4 | A3 | A2 | A1 | FC0 | FC1 | FC2 | IPL0 | IPL1 | IPL2 | BERR | VPA | E | VMA | RESET | HALT | GND | CLK7M | VCC | BR | BGACK | BG | DTACK | RW | LDS | UDS | AS | D16 | D17 | D18 | D19 | D20 | Published under the GNU Public License (GPL) v2 | TerribleFire 68K "Accelerator" / (C) 2016 S.J Leary | A5 | A6 | A7 | A8 | A9 | A10 | A11 | A12 | A13 | A14 | A15 | A16 | A17 | A18 | A19 | A20 | VCC | A21 | A22 | A23 | GND | D31 | D30 | D29 | D28 | D27 | D26 | D25 | D24 | D23 | D22 | D21
_tNames: C1 | OSC1 | R1 | JP3 | JP4 | C2 | C4 | U1 | C3 | JP2 | R4 | C5 | R5 | JP1 | JP7 | R2 | C6 | IC3 | IC1 | R6 | R7 | R8 | X1